# EAGLE design Motor_Controller (EAGLE 6.5.0)
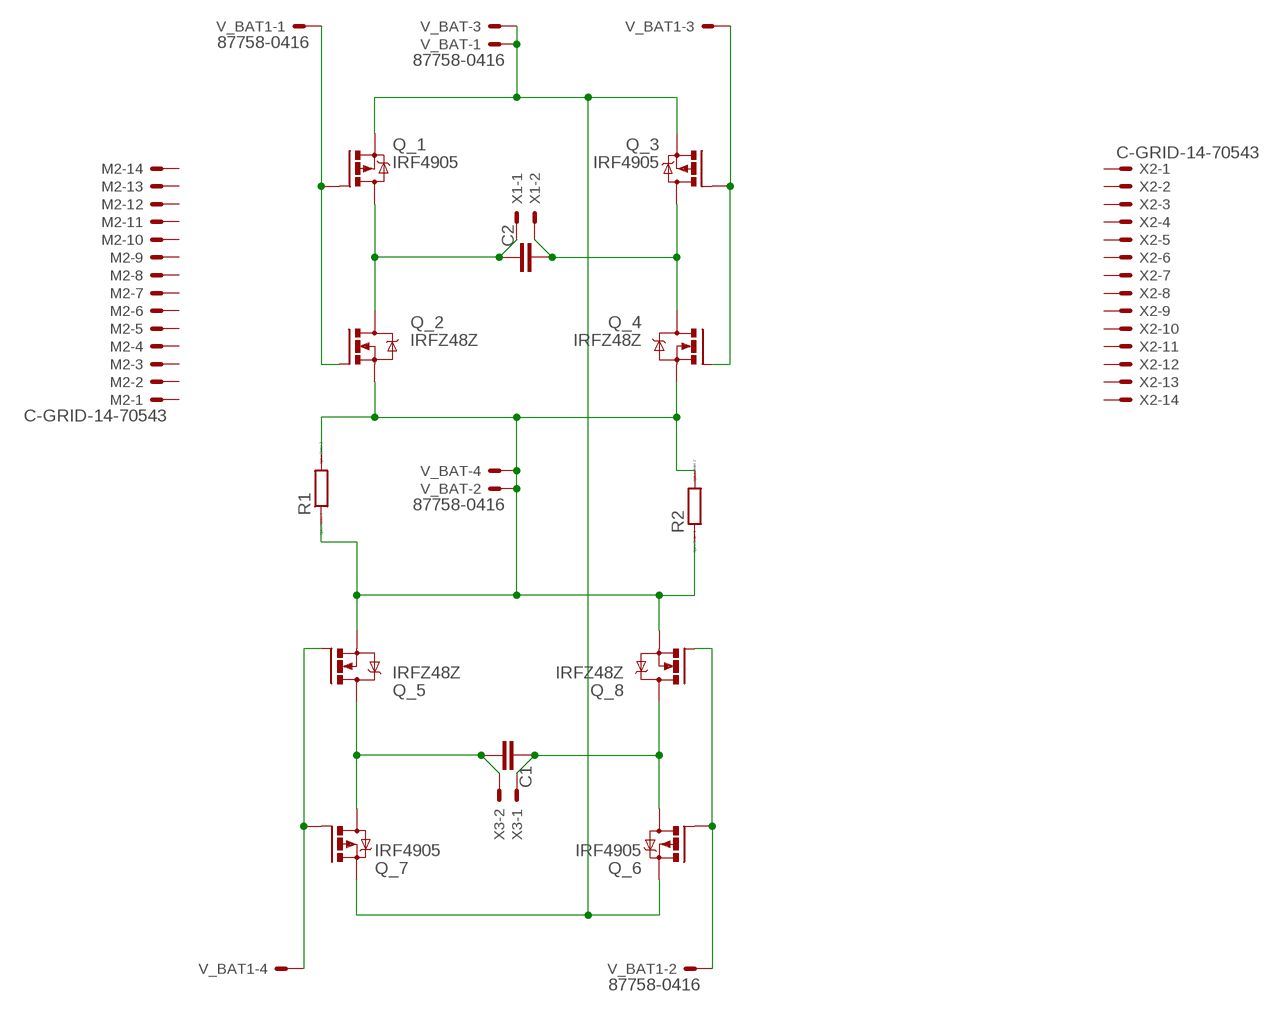
[diagram p0: schematic, sheet 1]

## Parts
C1  C5/3  [C5B3]
C2  C5/3  [C5B3]
M2  C-GRID-14-70543  [70543-14]
Q_1  IRF4905  [TO220BH]
Q_2  IRFZ48Z  [TO220BH]
Q_3  IRF4905  [TO220BH]
Q_4  IRFZ48Z  [TO220BH]
Q_5  IRFZ48Z  [TO220BH]
Q_6  IRF4905  [TO220BH]
Q_7  IRF4905  [TO220BH]
Q_8  IRFZ48Z  [TO220BH]
R1  R0204/7  [0204/7]
R2  R0204/7  [0204/7]
V_BAT  87758-0416  [87758-0416]
V_BAT1  87758-0416  [87758-0416]
X1  KK-156-2  [KK-156-2]
X2  C-GRID-14-70543  [70543-14]
X3  KK-156-2  [KK-156-2]

## Nets
N$1: C1.2 Q_5.D Q_7.D X3.2
N$2: C2.2 Q_3.D Q_4.D X1.2
N$4: Q_5.G Q_7.G V_BAT1.4
N$5: Q_6.G Q_8.G V_BAT1.2
N$6: Q_2.S Q_4.S Q_5.S Q_8.S R1.1 R1.2 R2.1 R2.2 V_BAT.2 V_BAT.4
N$12: Q_3.G Q_4.G V_BAT1.3
N$13: Q_1.G Q_2.G V_BAT1.1
Q_1: C1.1 Q_6.D Q_8.D X3.1
Q_2: C2.1 Q_1.D Q_2.D X1.1
Q_4: Q_1.S Q_3.S Q_6.S Q_7.S V_BAT.1 V_BAT.3
Unconnected: M2.1 M2.2 M2.3 M2.4 M2.5 M2.6 M2.7 M2.8 M2.9 M2.10 M2.11 M2.12 M2.13 M2.14 X2.1 X2.2 X2.3 X2.4 X2.5 X2.6 X2.7 X2.8 X2.9 X2.10 X2.11 X2.12 X2.13 X2.14

## Library data of the parts
C1 C2 = capacitor-wima:C: CAPACITOR naming: grid - package width
M2 X2 = con-molex:C-GRID-14: CONNECTOR wire to board 2.54 mm (0.100") pitch header; OC_FARNELL: unknown; OC_NEWARK: unknown
Q_1 Q_3 Q_6 Q_7 = transistor-power:IRF4905: P-Channel HEXFET® Power MOSFET RDS(on)= 0.02 Ohm, ID = -74A Source: http://www.irf.com/product-info/datasheets/data/irf4905pbf.pdf
Q_2 Q_4 Q_5 Q_8 = transistor-power:IRFZ48: N Channel HEXFET® Power MOSFET Logic Level Source: http://www.irf.com/product-info/datasheets/data/irfz48z.pdf
R1 R2 = eagle-ltspice:R: RESISTOR, European symbol; SPICEMODEL: NONE; SPICEPREFIX: R
V_BAT V_BAT1 = con-molex:87758-0416: 4 Pin - 2mm Dual Row Single Wafer, Vertical T/H HDR Source: http://www.molex.com/pdm_docs/sd/877580616_sd.pdf; MF: FARNELL; MPN: 87758-0416; OC_FARNELL: 7472315; OC_NEWARK: 39K3681
X1 X3 = con-molex:KK-156-2: KK 156 HEADER Source: http://www.molex.com/pdm_docs/sd/026604100_sd.pdf; OC_FARNELL: unknown; OC_NEWARK: unknown

## Board
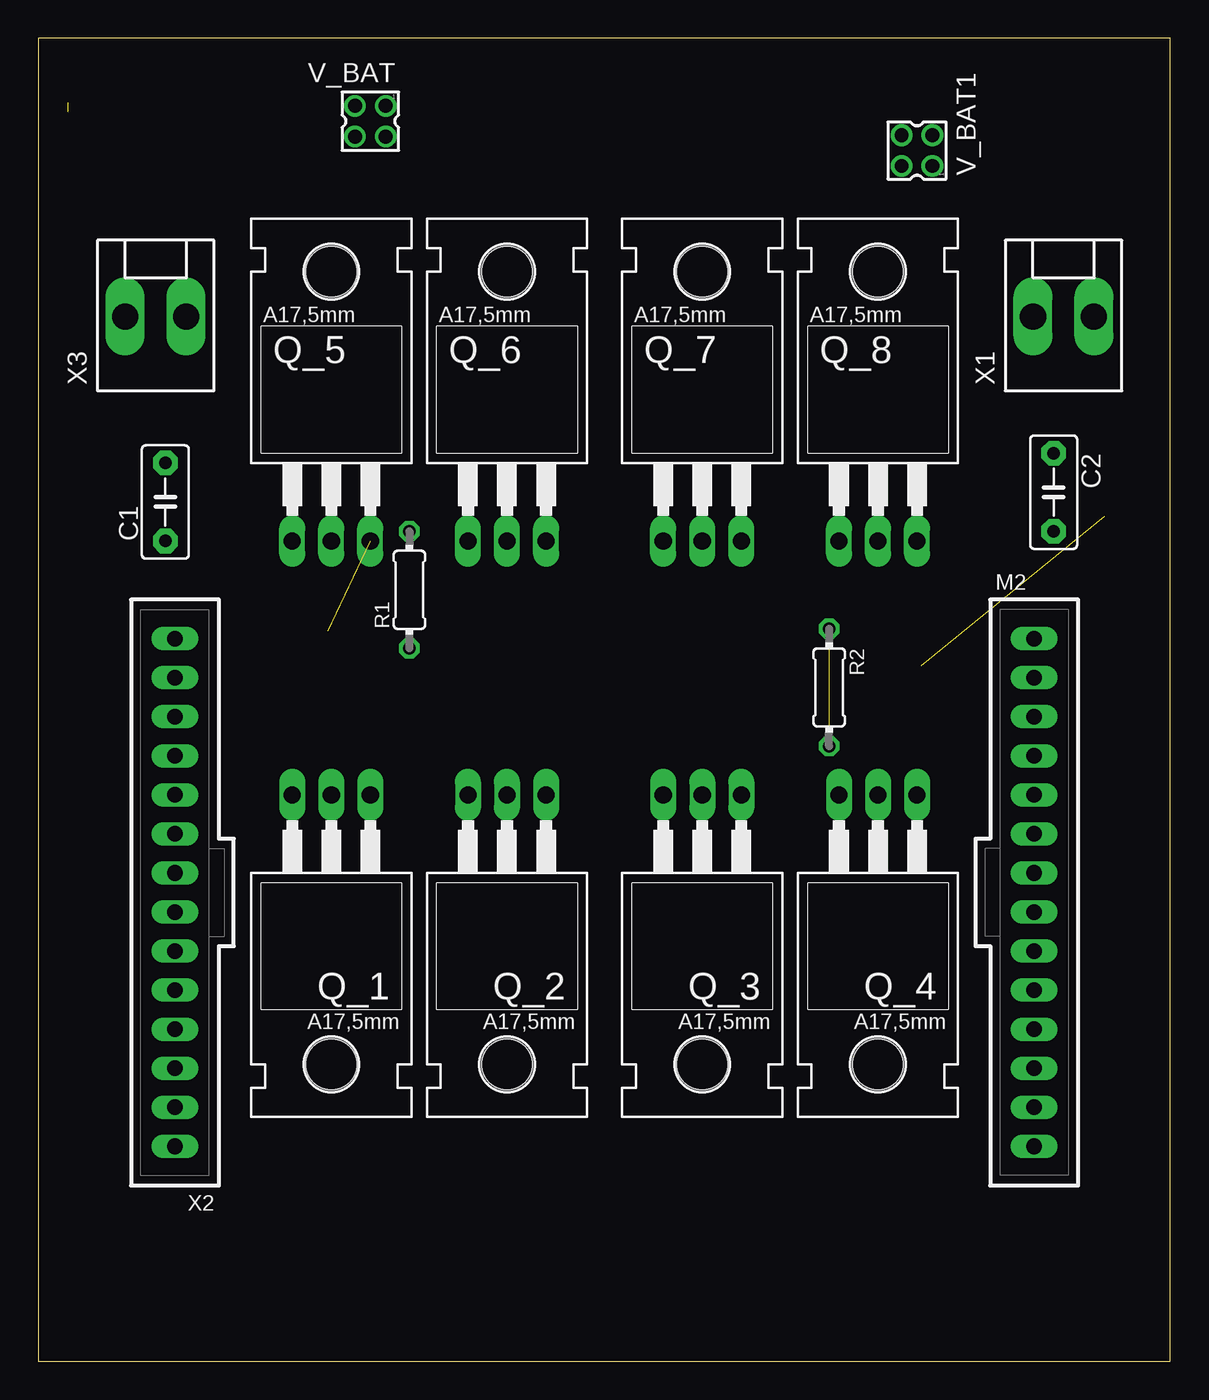
[diagram p1: board, top side]
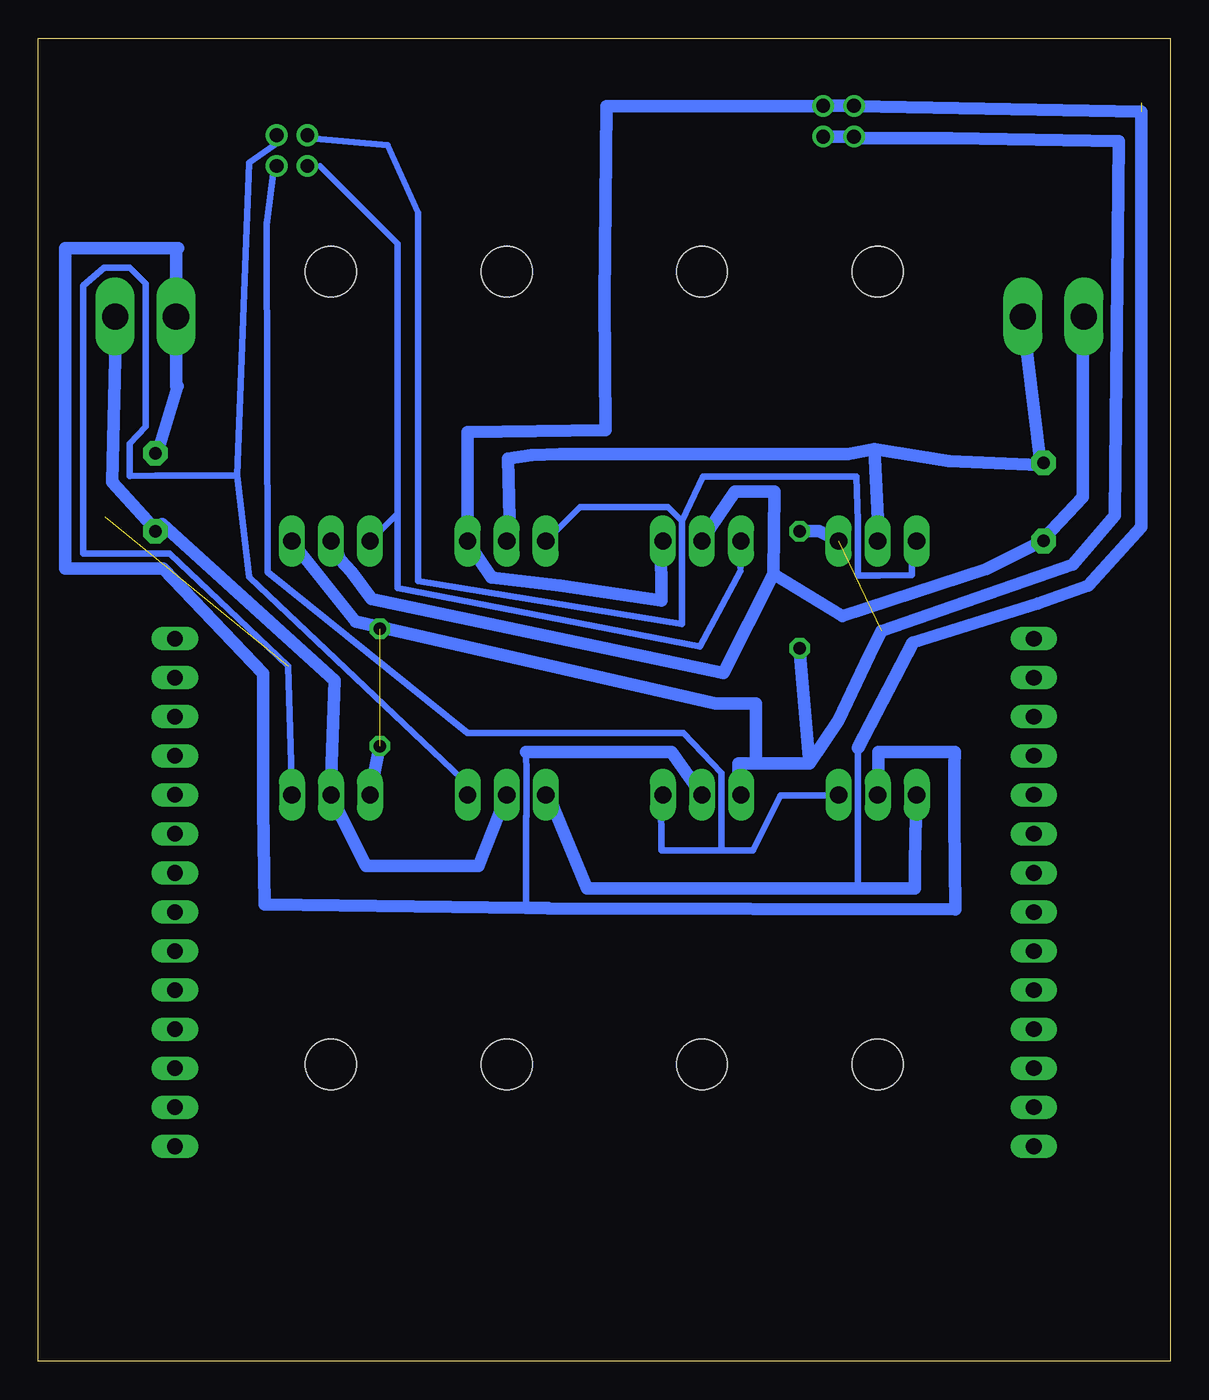
[diagram p2: board, bottom side, seen from below]

Size 73.64 x 86.03 mm. Coordinates in mm from the lower left corner, seen from the top.
Outline: 0,0 73.64,0 73.64,86.03 0,86.03 0,0
Copper layers (1*16): Top 0.035mm / dielectric 1.5mm / Bottom 0.035mm
Design rules "default": minimum track width 10mil, minimum drill 24mil, track to track 8mil, track to pad 8mil, pad to pad 8mil, via to via 8mil, smd to smd 8mil, copper to edge 40mil, drill to drill 8mil, minimum pad ring 10mil, minimum via ring 8mil, stop-mask expansion 4mil, vias tented up to drill 0mil, thermal gap 10mil

### Footprints (pad centres in the part's own frame; a part is rotated, then mirrored left to right if it is on the bottom)
C5B3 = drill 0.813 pad 1.6 octagon: 1 -2.54,0; 2 2.54,0
70543-14 = drill 1.016 long: 1 -16.51,0; 2 -13.97,0; 3 -11.43,0; 4 -8.89,0; 5 -6.35,0; 6 -3.81,0; 7 -1.27,0; 8 1.27,0; 9 3.81,0; 10 6.35,0; 11 8.89,0; 12 11.43,0; 13 13.97,0; 14 16.51,0
TO220BH = drill 1.118 long: D 0,-6.35; G -2.54,-6.35; S 2.54,-6.35 | hole 3.302: 0,11.176
0204/7 = drill 0.813 octagon: 1 -3.81,0; 2 3.81,0
87758-0416 = drill 0.9 pad 1.27: 1 -1,-1; 2 -1,1; 3 1,-1; 4 1,1
KK-156-2 = drill 1.7 pad 2.184 long: 1 -1.98,0; 2 1.98,0

### Placement (x,y rotation side)
C1  8.26,55.88 90 top
C2  66.04,56.52 270 top
M2  64.77,30.48 270 top
Q_1  19.05,30.48 180 top
Q_2  30.48,30.48 180 top
Q_3  43.18,30.48 180 top
Q_4  54.61,30.48 180 top
Q_5  19.05,59.69 0 top
Q_6  30.48,59.69 0 top
Q_7  43.18,59.69 0 top
Q_8  54.61,59.69 0 top
R1  24.13,50.16 90 top
R2  51.44,43.81 270 top
V_BAT  21.59,80.64 180 top
V_BAT1  57.15,78.74 90 top
X1  66.67,67.94 0 top
X2  8.89,30.48 90 top
X3  7.62,67.94 0 top

### Tracks (layer width: path | path; a pad name or v marks a point on that pad's centre or on a via)
N$1
  Bottom 0.254: 8.46,58.52 C1.2 | 18.97,53.49 Q_5.D 19.25,59.31
  Bottom 0.305: 9.37,67.89 X3.2 | 42.98,53.49 Q_7.D
  Bottom 0.813: 8.46,58.52 9.47,66.73 9.37,67.89 | 19.25,59.31 14.43,58.55 8.46,58.29 C1.2 | 19.25,59.31 18.97,53.49 | 42.98,53.49 43.1,58.7 41.58,58.93 39.73,59 20.98,59 19.25,59.31
N$2
  Bottom 0.254: 54.63,36.8 Q_4.D 54.63,37.03 | 66.06,54.18 C2.2 | 68.58,67.89 X1.2
  Bottom 0.813: Q_3.D 45.01,32.21 52.32,32.21 54.63,36.8 | 66.06,54.18 66.57,54.66 68.83,57.17 68.58,67.89 | 54.63,37.03 54.38,44.27 65.58,54.46 C2.2
N$4
  Bottom 0.254: 56.01,79.55 V_BAT1.4 | 40.46,53.49 Q_7.G
  Bottom 0.305: 16.69,53.26 Q_5.G
  Bottom 0.406: 56.01,79.55 50.93,79.1 48.95,74.7 48.95,53.47 48.96,50.75 31.77,47.95 31.77,54.63 | 31.77,54.63 32.69,55.55 38.41,55.55 40.46,53.49 | 16.69,53.26 16.82,51.87 16.82,51.13 18.95,51.09 20.32,51.08 20.34,52.12 20.34,54.63 20.45,57.53 30.4,57.53 31.77,54.63
N$5
  Bottom 0.254: 55.32,77.72 56.01,77.72 V_BAT1.2 | 50.27,55.12 50.29,55.09 | 51.89,53.49 Q_8.G | 27.99,51.38 27.99,51.61 | 28.12,53.26 Q_6.G
  Bottom 0.406: 55.32,77.72 50.29,72.69 50.29,55.09 | 51.89,53.49 50.27,55.12 50.27,50.29 30.61,46.48 27.99,51.38 | 27.99,51.61 28.12,53.26
N$6  (2 unrouted)
  Bottom 0.254: 28.12,37.72 28.12,37.03 | 57.15,53.26 Q_8.S | 20.57,79.55 V_BAT.4
  Bottom 0.305: 53.01,48.11 52.07,47.85
  Bottom 0.406: 52.07,47.85 R2.1
  Bottom 0.813: V_BAT.2 V_BAT.4 | 57.15,53.26 53.01,48.11 29.62,42.77 26.98,42.77 26.98,38.86 | 28.12,37.03 Q_2.S 28.12,37.72 28.12,38.86 26.98,38.86 | 20.57,79.55 14.25,79.55 3.38,79.35 3.63,54.99 6.35,51.82 18.8,47.5 19.56,45.97 21.59,41.66 23.5,38.86 | 26.98,38.86 23.5,38.86 | R2.2 Q_4.S | Q_5.S 22.86,53.98 R1.2 | R1.1 23.5,38.86
N$12  (1 unrouted)
  Bottom 0.254: 58.29,79.55 V_BAT1.3
  Bottom 0.305: 70.73,69.95 70.74,69.95
  Bottom 0.406: 58.29,79.55 58.29,79.1 59.94,77.95 60.71,57.58 | 60.71,57.58 59.94,51 45.47,37.29 Q_3.G | Q_4.G 57.4,45.21 65.09,52.51 70.74,52.51 70.74,69.95 | 70.73,69.95 69.37,71.12 67.7,71.12 66.66,70.08 66.66,60.78 67.72,59.66 67.72,57.57 66.02,57.58 60.71,57.58
N$13
  Bottom 0.254: 58.29,77.72 V_BAT1.1 | 33.15,36.8 Q_2.G | 21.72,36.8 Q_1.G
  Bottom 0.305: 58.79,74.05 58.8,73.91 | 29.2,35.5 29.21,35.43 | 28.32,33.21 28.32,33.22 | 29.21,33.22 29.21,33.21
  Bottom 0.406: 58.8,73.91 58.29,77.72 | 58.79,74.05 58.73,51.31 45.72,40.84 31.67,40.84 29.2,38.24 29.2,35.5 | 33.15,36.8 33.12,33.22 29.21,33.22 29.21,35.43 | 21.72,36.8 25.38,36.8 27.18,33.22 28.32,33.22 | 29.21,33.21 28.32,33.21
Q_1
  Bottom 0.254: 8.23,53.49 C1.1 | 5.71,67.89 X3.1 | 30.4,53.49 Q_6.D | 54.41,53.26 Q_8.D
  Bottom 0.813: 8.23,53.49 5.69,56.19 5.71,59.21 5.71,67.89 | 30.4,53.49 28.35,56.57 25.76,56.57 25.83,51.18 | 25.83,51.18 21.34,48.46 11.99,51.51 8.46,53.26 C1.1 | 54.41,53.26 54.03,52.12 53.26,51.32 51.97,49.58 29.08,44.76 25.83,51.18
Q_2
  Bottom 0.254: 30.63,37.03 Q_2.D
  Bottom 0.305: 41.91,35.56 41.91,35.43 41.9,35.43 | 40.49,29.46 40.49,29.45
  Bottom 0.406: 41.9,35.43 41.9,38.18 41.91,39.62 | 41.91,35.43 41.91,29.46
  Bottom 0.813: C2.1 65.84,59.21 64.57,63.42 64.69,63.42 X1.1 64.69,72.39 | 40.49,29.45 13.99,29.39 14.05,35.18 14.05,38.68 14.03,39.62 18.99,39.62 18.97,37.03 Q_1.D | 41.91,39.62 32.46,39.62 30.63,37.03 | 40.49,29.46 41.91,29.46 58.93,29.72 59.03,35.92 59.03,44.73 65.53,51.56 71.88,51.56 71.88,72.39 64.69,72.39 | 64.54,72.39 64.69,72.39
Q_4  (1 unrouted)
  Bottom 0.254: 40.46,36.8 Q_3.S | 33.15,53.26 Q_6.S | 45.72,53.26 Q_7.S | 22.63,81.61 V_BAT.1 | 20.57,81.61 V_BAT.3
  Bottom 0.406: 20.34,39.88 20.34,30.73
  Bottom 0.813: V_BAT.3 V_BAT.1 | 40.46,36.8 37.95,30.73 20.34,30.73 16.62,30.73 16.62,32.51 16.56,35.41 16.69,36.8 Q_1.S | 33.15,53.26 33.1,49.45 39.73,50.44 44.17,50.95 45.72,53.26 | 22.63,81.61 36.7,81.61 36.83,69.09 36.77,60.55 45.72,60.43 Q_7.S | 20.34,39.88 16.76,46.74 8.64,49.28 5.33,50.44 1.91,54.25 1.91,81.28 20.57,81.61